# Altium schematic sheet Precharge.SchDoc
size A3; SheetNumber: 9; SheetTotal: 10
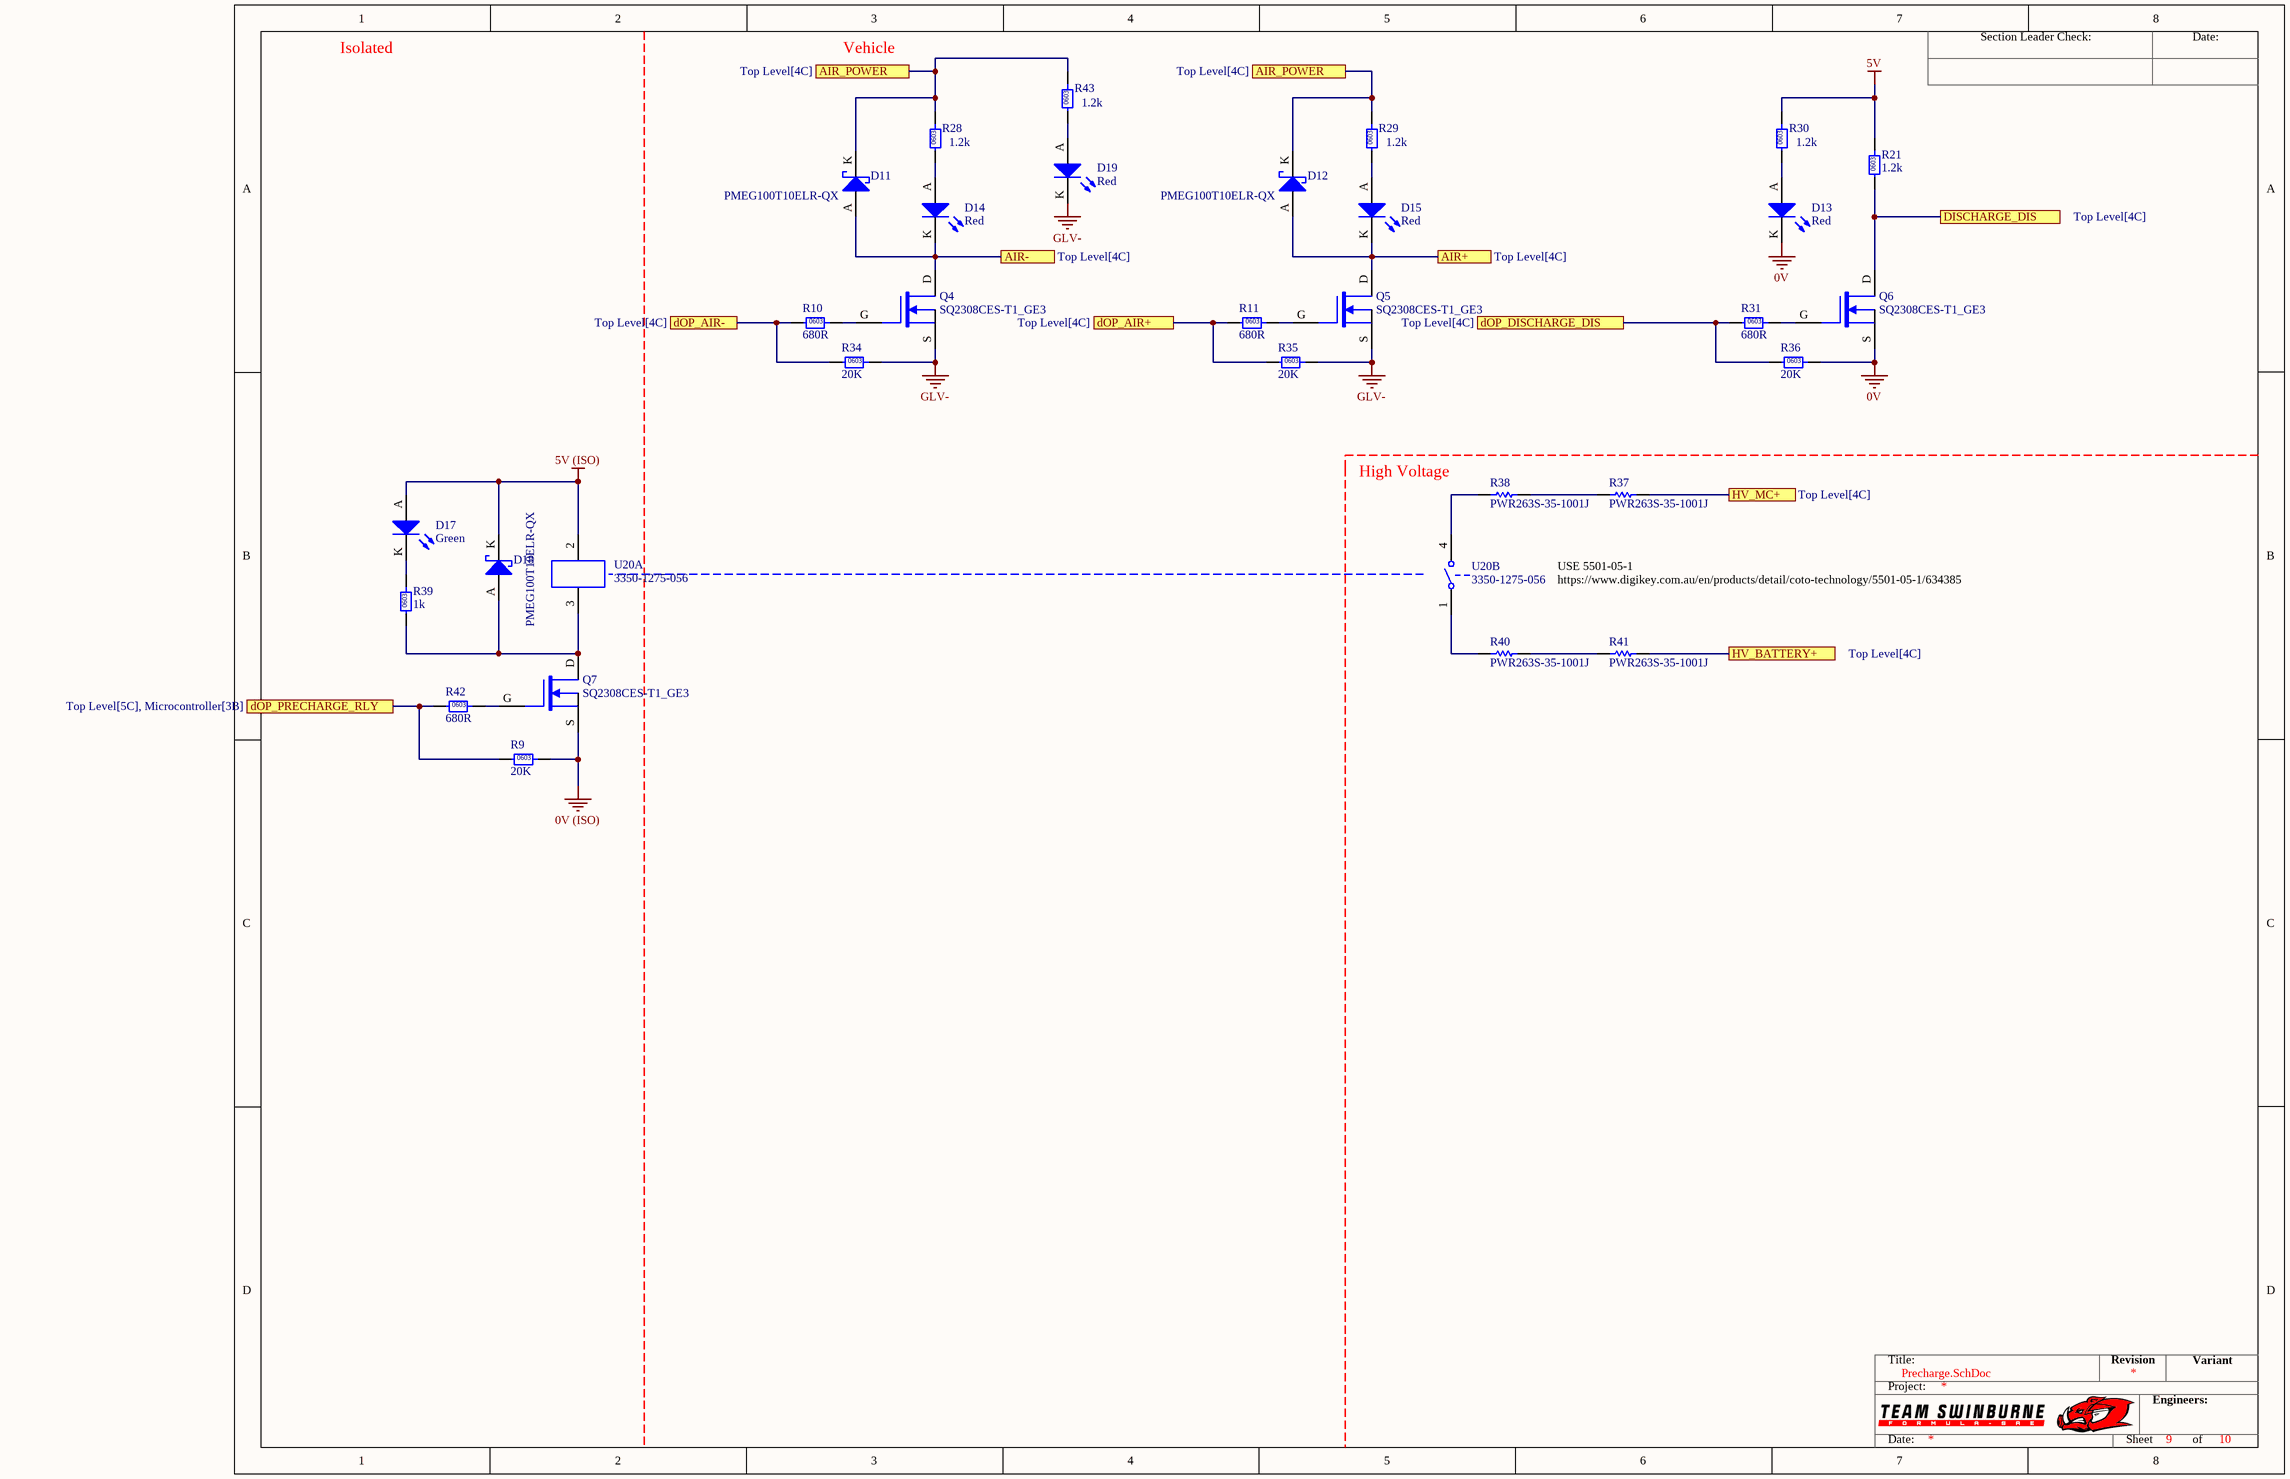
[diagram p0: Precharge.SchDoc]

## Parts
D11  PMEG100T10ELR-QX  [NXP SOD123W]
D12  PMEG100T10ELR-QX  [NXP SOD123W]
D13  Red  [0805 LED]
D14  Red  [0805 LED]
D15  Red  [0805 LED]
D17  Green  [0805 LED]
D18  PMEG100T10ELR-QX  [NXP SOD123W]
D19  Red  [0805 LED]
Q4  SQ2308CES-T1_GE3  [VSHY SOT-23-3]
Q5  SQ2308CES-T1_GE3  [VSHY SOT-23-3]
Q6  SQ2308CES-T1_GE3  [VSHY SOT-23-3]
Q7  SQ2308CES-T1_GE3  [VSHY SOT-23-3]
R9  20K  [0603]
R10  680R  [0603]
R11  680R  [0603]
R21  1.2k  [0603]
R28  1.2k  [0603]
R29  1.2k  [0603]
R30  1.2k  [0603]
R31  680R  [0603]
R34  20K  [0603]
R35  20K  [0603]
R36  20K  [0603]
R37  PWR263S-35-1001J  [B TO-263]
R38  PWR263S-35-1001J  [B TO-263]
R39  1k  [0603]
R40  PWR263S-35-1001J  [B TO-263]
R41  PWR263S-35-1001J  [B TO-263]
R42  680R  [0603]
R43  1.2k  [0603]
U20  3350-1275-056  [CI SPST]  (parts A,B of 2)

## Ports
AIR+ (see Top Level[4C]), AIR- (see Top Level[4C]), AIR_POWER (see Top Level[4C]), DISCHARGE_DIS (see Top Level[4C]), dOP_AIR+ (see Top Level[4C]), dOP_AIR- (see Top Level[4C]), dOP_DISCHARGE_DIS (see Top Level[4C]), dOP_PRECHARGE_RLY (see Top Level[5C], Microcontroller[3B]), HV_BATTERY+ (see Top Level[4C]), HV_MC+ (see Top Level[4C])

## Nets
0V: D13.K Q6.S R36.2
0V (ISO): Q7.S R9.2
5V: R21.2 R30.2
5V (ISO): D17.A D18.K U20.2
GLV-: D19.K Q4.S Q5.S R34.2 R35.2
AIR+: D12.A D15.K Q5.D ; port AIR+
AIR-: D11.A D14.K Q4.D ; port AIR-
AIR_POWER: D11.K D12.K R28.2 R29.2 R43.2 ; port AIR_POWER
DISCHARGE_DIS: Q6.D R21.1 ; port DISCHARGE_DIS
dOP_AIR+: R11.1 R35.1 ; port dOP_AIR+
dOP_AIR-: R10.1 R34.1 ; port dOP_AIR-
dOP_DISCHARGE_DIS: R31.1 R36.1 ; port dOP_DISCHARGE_DIS
dOP_PRECHARGE_RLY: R9.1 R42.1 ; port dOP_PRECHARGE_RLY
HV_BATTERY+: R41.2 ; port HV_BATTERY+
HV_MC+: R37.1 ; port HV_MC+
NetD13_A: D13.A R30.1
NetD14_A: D14.A R28.1
NetD15_A: D15.A R29.1
NetD17_K: D17.K R39.2
NetD18_A: D18.A Q7.D R39.1 U20.3
NetD19_A: D19.A R43.1
NetQ4_G: Q4.G R10.2
NetQ5_G: Q5.G R11.2
NetQ6_G: Q6.G R31.2
NetQ7_G: Q7.G R42.2
NetR37_2: R37.2 R38.1
NetR38_2: R38.2 U20.4
NetR40_1: R40.1 U20.1
NetR40_2: R40.2 R41.1

## Notes on the sheet
- Isolated
- Vehicle
- (near R38) High Voltage
- USE 5501-05-1
- https://www.digikey.com.au/en/products/detail/coto-technology/5501-05-1/634385
- Section Leader Check:
- Date:
- Title:
- Revision
- Variant
- Project:
- Engineers:
- Sheet
- of
- (in symbol RC0603FR-071KL) 0603
- (in symbol RC0603FR-0720KL) 0603
- (in symbol RC0603JR-071K2L) 0603
- (in symbol RC0603JR-13680RL) 0603

## Library data of the parts
D11 D12 D18 = PMEG100T10ELR-QX: Manufacturer: Nexperia USA Inc.; Forward Voltage: 0.75 V @ 1A; Breakdown Voltage: 100 V; Rated Power: 680 mW; Part Number: PMEG100T10ELR-QX; Digikey Part Number: 1727-PMEG100T10ELR-QXCT-ND
D13-D15 D19 = SML-210LTT86: Red LED Indication - Discrete 1.75V 0805 (2012 Metric); Manufacturer: ROHM Semiconductor; Part Number: SML-210LTT86; Colour: Red; Digikey Part Number: 511-1286-1-ND
D17 = SML-210FTT86: Green LED Indication - Discrete 1.75V 0805 (2012 Metric); Manufacturer: ROHM Semiconductor; Part Number: SML-210FTT86; Colour: Green; Digikey Part Number: 511-1285-1-ND; Digikey Link: https://www.digikey.com/product-detail/en/rohm-semiconductor/SML-210FTT86/511-1285-1-ND/637098
Q4-Q7 = SQ2308CES-T1_GE3: MOSFET N-CH 60V 2.3A SOT23; Manufacturer: Vishay Siliconix; Type: N-channel; Rated Power: 2W; Published: 24-Mar-1999; LatestRevisionDate: 29-May-2009; LatestRevisionNote: IPC-7351 Footprint Added.; PackageVersion: Sep-2000; PackageReference: SOT-343; Publisher: Altium Limited; PackageDescription: 4-Pin SOT-343 Package 1.3 mm Pitch, 2.1 mm Lead Span; Part Number: SQ2308CES-T1_GE3; Digikey Part Number: SQ2308CES-T1_GE3CT-ND
R9 R34-R36 = RC0603FR-0720KL: Manufacturer: YAGEO; Tolerance: 0.01; Rated Power: 0.1W; Part Number: RC0603FR-0720KL; Value: 20K; Material: FR-07; Digikey Part Number: 311-20.0KHRCT-ND
R10 R11 R31 R42 = RC0603JR-13680RL: Manufacturer: YAGEO; Tolerance: 0.01; Rated Power: 0.1W; Part Number: RC0603JR-13680RL; Value: 680R; Material: FR-07; Digikey Part Number: 13-RC0603JR-13680RLCT-ND
R21 R28-R30 R43 = RC0603JR-071K2L: Manufacturer: YAGEO; Tolerance: 0.01; Rated Power: 0.1W; Part Number: RC0603JR-071K2L; Value: 1.2k; Material: FR-07; Digikey Part Number: 311-1.2KGRCT-ND
R37 R38 R40 R41 = CMP-037-000402-1: Manufacturer: Bournes Inc; Value: 1k; Rated Voltage: 35W; Tolerance: 0.05; Part Number: PWR263S-35-1001J; Digikey Part Number: PWR263S-35-1001J-ND
R39 = RC0603FR-071KL: Manufacturer: YAGEO; Tolerance: 0.01; Rated Power: 0.1W; Part Number: RC0603FR-071KL; Value: 1k; Material: FR-07; Digikey Part Number: 311-1.00KHRCT-ND
U20 = 3350-1275-056: RELAY REED HV SPST 200W 3A 5V (NO); Manufacturer: Comus International; Part Number: 3350-1275-056; Digikey Part Number: 1835-1036-ND; Digikey Link: https://www.digikey.com.au/product-detail/en/comus-international/3350-1275-056/1835-1036-ND/7515918